# Altium project PCB_Project.PrjPcb
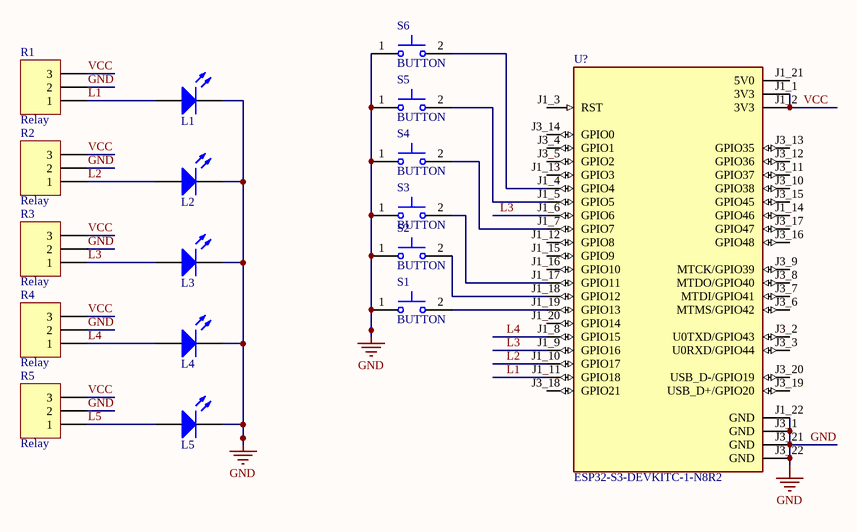
[diagram p0: Sheet1.SchDoc]
3 sheets, 39 parts. Net scope: global (net labels, ports and power ports of the same name join across sheets).
Sheets:
  Sheet1.SchDoc
  Sheet2.SchDoc
  Sheet3.SchDoc

## Sheet Sheet1.SchDoc
size A; SheetNumber: 1; SheetTotal: 1

### Parts
(Parts that share a designator on the sheet are numbered #1, #2 ... from top to bottom, then left to right.)
L1  LED 0805 SMD  [LED 0805 SMD]  (value not drawn)
L2  LED 0805 SMD  [LED 0805 SMD]  (value not drawn)
L3  LED 0805 SMD  [LED 0805 SMD]  (value not drawn)
L4  LED 0805 SMD  [LED 0805 SMD]  (value not drawn)
L5  LED 0805 SMD  [LED 0805 SMD]  (value not drawn)
R1  Relay  [HDR1X3]
R2  Relay  [HDR1X3]
R3  Relay  [HDR1X3]
R4  Relay  [HDR1X3]
R5  Relay  [HDR1X3]
S1  BUTTON  [SW_BUTT-2 pin]
S2  BUTTON  [SW_BUTT-2 pin]
S3  BUTTON  [SW_BUTT-2 pin]
S4  BUTTON  [SW_BUTT-2 pin]
S5  BUTTON  [SW_BUTT-2 pin]
S6  BUTTON  [SW_BUTT-2 pin]
U?#1  ESP32-S3-DEVKITC-1-N8R2  [XCVR_ESP32-S3-DEVKITC-1-N8R2]

### Nets
GND: L1.2(K) L2.2(K) L3.2(K) L4.2(K) L5.2(K) R1.2 R2.2 R3.2 R4.2 R5.2 S1.1 S2.1 S3.1 S4.1 S5.1 S6.1 U?#1.J1_22(GND) U?#1.J3_1(GND) U?#1.J3_21(GND) U?#1.J3_22(GND)
L1: L1.1(A) R1.1 U?#1.J1_11(GPIO18)
L2: L2.1(A) R2.1 U?#1.J1_10(GPIO17)
L3: L3.1(A) R3.1 U?#1.J1_6(GPIO6) U?#1.J1_9(GPIO16)
L4: L4.1(A) R4.1 U?#1.J1_8(GPIO15)
L5: L5.1(A) R5.1
VCC: R1.3 R2.3 R3.3 R4.3 R5.3 U?#1.J1_1(3V3) U?#1.J1_2(3V3)
NetS1_2: S1.2 U?#1.J1_19(GPIO13)
NetS2_2: S2.2 U?#1.J1_18(GPIO12)
NetS3_2: S3.2 U?#1.J1_17(GPIO11)
NetS4_2: S4.2 U?#1.J1_7(GPIO7)
NetS5_2: S5.2 U?#1.J1_5(GPIO5)
NetS6_2: S6.2 U?#1.J1_4(GPIO4)

Not connected (* = marked no-connect by the designer): U?#1 J1_3(RST) J1_12(GPIO8) J1_13(GPIO3) J1_14(GPIO46) J1_15(GPIO9) J1_16(GPIO10) J1_20(GPIO14) J1_21(5V0) J3_2(U0TXD/GPIO43) J3_3(U0RXD/GPIO44) J3_4(GPIO1) J3_5(GPIO2) J3_6(MTMS/GPIO42) J3_7(MTDI/GPIO41) J3_8(MTDO/GPIO40) J3_9(MTCK/GPIO39) J3_10(GPIO38) J3_11(GPIO37) J3_12(GPIO36) J3_13(GPIO35) J3_14(GPIO0) J3_15(GPIO45) J3_16(GPIO48) J3_17(GPIO47) J3_18(GPIO21) J3_19(USB_D+/GPIO20) J3_20(USB_D-/GPIO19)

### Library data of the parts
L1-L5 = LED 0805 SMD: Green 571nm LED Indication - Discrete 2V 0805 (2012 Metric); Supplier 1: Digi-Key; Supplier Part Number 1: 160-1426-1-ND; Value: LED 0805 SMD
R1-R5 = Header 3X1: CONN HEADER 3POS .100" SINGL TIN; LatestRevisionDate: 17-Jul-2002; LatestRevisionNote: Re-released for DXP Platform.; Publisher: Altium Limited; Supplier 1: Digi-Key; Supplier Part Number 1: SAM1035-03-ND; Value: Relay
S1-S6 = BUTT-2: Tactile Switches MINI PUSH BUTTON SWITCH 2-PIN QTY. 4; MF: Gravitech; Mouser-Purchase-URL: https://snapeda.com/shop?store=Mouser&id=885822; Price: None; Package: None; Value: *; MP: BUTT-2; SnapEDA_Link: https://www.snapeda.com/parts/BUTT-2/Gravitech/view-part/885822/?ref=snap; Availability: Warning
U?#1 = ESP32-S3-DEVKITC-1-N8R2: WiFi Development Tools - 802.11 (Engineering Samples Only) ESP32-S3 General-Purpose Development Board, ESP32-S3-WROOM-1-N8R2, with Pin Header; MF: Espressif Systems; SnapEDA_Link: https://www.snapeda.com/parts/ESP32-S3-DEVKITC-1-N8R2/Espressif+Systems/view-part/?ref=snap; Package: None; Value: *; MP: ESP32-S3-DEVKITC-1-N8R2; Check_prices: https://www.snapeda.com/parts/ESP32-S3-DEVKITC-1-N8R2/Espressif+Systems/view-part/?ref=eda

## Sheet Sheet2.SchDoc
size A; SheetNumber: 2; SheetTotal: 2
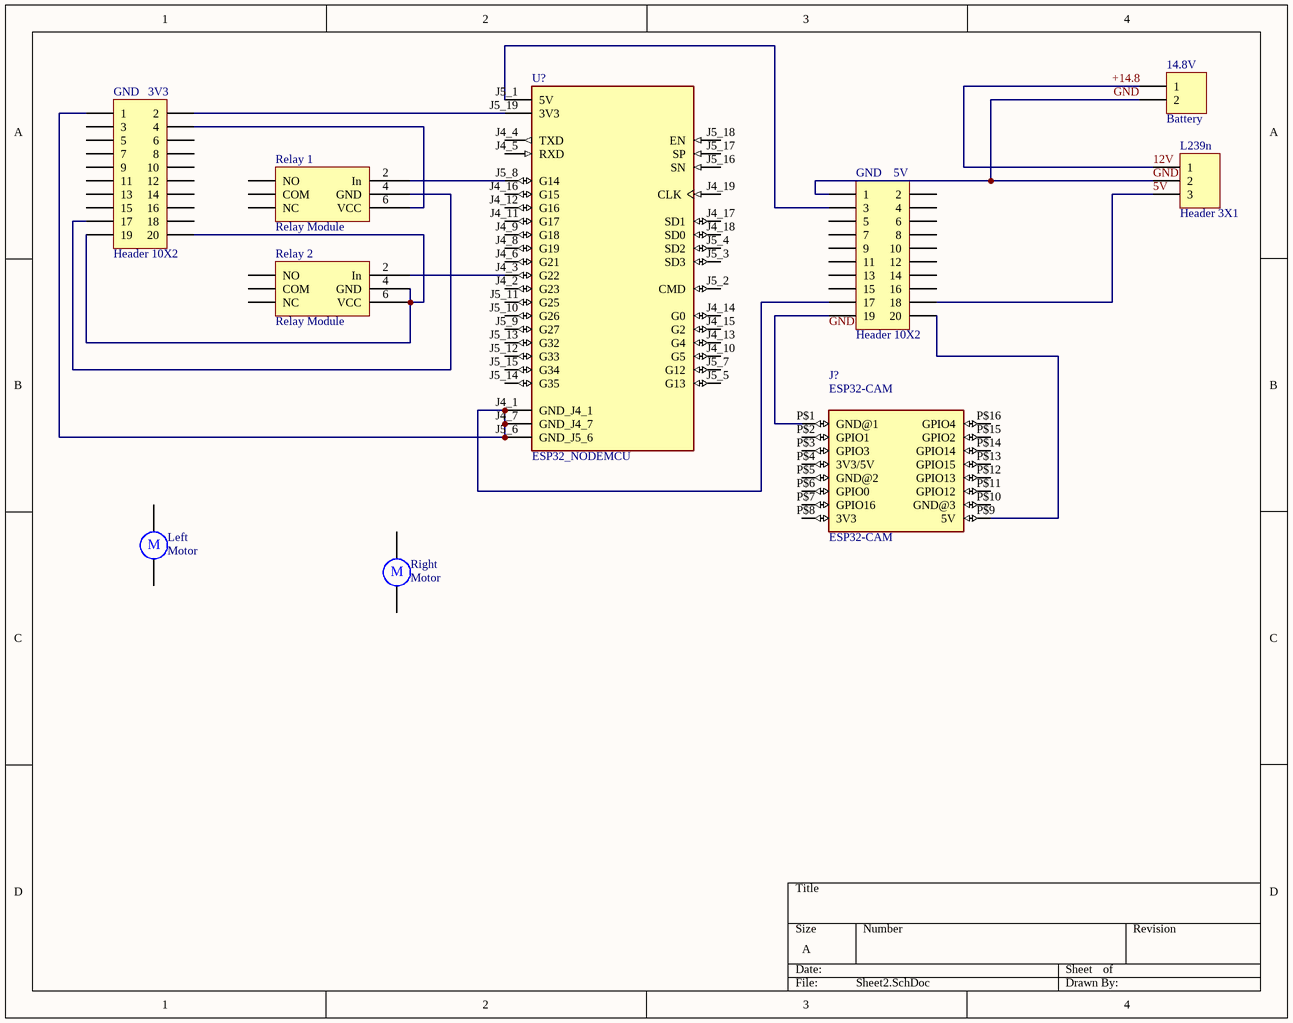
[diagram p1: Sheet2.SchDoc]

### Parts
(Parts that share a designator on the sheet are numbered #1, #2 ... from top to bottom, then left to right.)
14.8V  Battery  [HDR1X2_R]
GND_3V3  Header 10X2  [HDR2X10]
GND_5V  Header 10X2  [HDR2X10]
J?#1  ESP32-CAM  [ESP32-CAM]
L239n  Header 3X1  [HDR1X3]
Left  Motor  [RB5-10.5]
Relay_1  Relay Module  [HDR3X2]
Relay_2  Relay Module  [HDR3X2]
Right  Motor  [RB5-10.5]
U?#2  ESP32_NODEMCU  [MODULE_ESP32_NODEMCU]

### Nets
GND: 14.8V.2 GND_5V.1 L239n.2
5V: GND_5V.18 L239n.3
+14.8: 14.8V.1 L239n.1  [also labelled 12V]
NetGND_3V3_1: GND_3V3.1 GND_5V.17 U?#2.J4_1(GND_J4_1) U?#2.J4_7(GND_J4_7) U?#2.J5_6(GND_J5_6)
NetGND_3V3_2: GND_3V3.2 U?#2.J5_19(3V3)
NetGND_3V3_4: GND_3V3.4 Relay_1.6(VCC)
NetGND_3V3_17: GND_3V3.17 Relay_1.4(GND)
NetGND_3V3_19: GND_3V3.19 GND_3V3.20 Relay_2.4(GND) Relay_2.6(VCC)
NetGND_5V_3: GND_5V.3 U?#2.J5_1(5V)
NetGND_5V_19: GND_5V.19 J?#1.P$1(GND@1)
NetGND_5V_20: GND_5V.20 J?#1.P$9(5V)
NetRelay_1_2: Relay_1.2(In) U?#2.J5_8(G14)
NetRelay_2_2: Relay_2.2(In) U?#2.J4_3(G22)

Not connected (* = marked no-connect by the designer): GND_3V3 3 5 6 7 8 9 10 11 12 13 14 15 16 18; GND_5V 2 4 5 6 7 8 9 10 11 12 13 14 15 16; J?#1 P$2(GPIO1) P$3(GPIO3) P$4(3V3/5V) P$5(GND@2) P$6(GPIO0) P$7(GPIO16) P$8(3V3) P$10(GND@3) P$11(GPIO12) P$12(GPIO13) P$13(GPIO15) P$14(GPIO14) P$15(GPIO2) P$16(GPIO4); Left 1 2; Relay_1 1(NO) 3(COM) 5(NC); Relay_2 1(NO) 3(COM) 5(NC); Right 1 2; U?#2 J4_2(G23) J4_4(TXD) J4_5(RXD) J4_6(G21) J4_8(G19) J4_9(G18) J4_10(G5) J4_11(G17) J4_12(G16) J4_13(G4) J4_14(G0) J4_15(G2) J4_16(G15) J4_17(SD1) J4_18(SD0) J4_19(CLK) J5_2(CMD) J5_3(SD3) J5_4(SD2) J5_5(G13) J5_7(G12) J5_9(G27) J5_10(G26) J5_11(G25) J5_12(G33) J5_13(G32) J5_14(G35) J5_15(G34) J5_16(SN) J5_17(SP) J5_18(EN)

### Notes on the sheet
- Labels drawn without touching a wire or pin: GND
- (in symbol Motor) M

### Library data of the parts
14.8V = Socket_2X1: SOCKET 2POS .100" SINGL TIN; LatestRevisionDate: 17-Jul-2002; LatestRevisionNote: Re-released for DXP Platform.; Publisher: Altium Limited; Supplier 1: Digi-Key; Supplier Part Number 1: ED11155-ND; Value: Battery
GND_3V3 GND_5V = Header 10X2: Header, 10-Pin, Dual row; LatestRevisionDate: 17-Jul-2002; LatestRevisionNote: Re-released for DXP Platform.; Publisher: Altium Limited
J?#1 = ESP32-CAM: ESP32 ESP32 Transceiver; 802.11 a/b/g/n (Wi-Fi, WiFi, WLAN), BluetoothÂ® Smart 4.x Low Energy (BLE) Evaluation Board; MF: AI-Thinker; SnapEDA_Link: https://www.snapeda.com/parts/ESP32-CAM/AI-Thinker/view-part/?ref=snap; Package: None; Value: *; MP: ESP32-CAM; Check_prices: https://www.snapeda.com/parts/ESP32-CAM/AI-Thinker/view-part/?ref=eda
L239n = Header 3X1: CONN HEADER 3POS .100" SINGL TIN; LatestRevisionDate: 17-Jul-2002; LatestRevisionNote: Re-released for DXP Platform.; Publisher: Altium Limited; Supplier 1: Digi-Key; Supplier Part Number 1: SAM1035-03-ND; Value: Header 3X1
Left Right = Motor: Motor, General Kind; Published: 24-Mar-1999; LatestRevisionDate: 17-Jul-2002; LatestRevisionNote: Re-released for DXP Platform.; PackageReference: RB5-10.5; Publisher: Altium Limited; PackageDescription: Capacitor (Radial); 2 Leads
Relay_1 Relay_2 = Relay: CONN HEADER 3POS .100" SINGL TIN; LatestRevisionDate: 17-Jul-2002; LatestRevisionNote: Re-released for DXP Platform.; Publisher: Altium Limited; Supplier 1: Digi-Key; Supplier Part Number 1: SAM1035-03-ND; Value: Relay Module
U?#2 = ESP32_NODEMCU: NodeMCU is an open source loT platform. ESP32 is a series of low cost, low powersystem-on-chip (SoC) microcontrollers with integrated Wi-Fi & dual-mode Bluetooth.; MP: ESP32 NodeMCU; MF: Espressif Systems; Package: Package; SnapEDA_Link: https://www.snapeda.com/parts/ESP32%20NodeMCU/Espressif+Systems/view-part/?ref=snap; Availability: Not in stock; Value: *; Check_prices: https://www.snapeda.com/parts/ESP32%20NodeMCU/Espressif+Systems/view-part/?ref=eda; Price: None

## Sheet Sheet3.SchDoc
size A; SheetNumber: 3; SheetTotal: 3
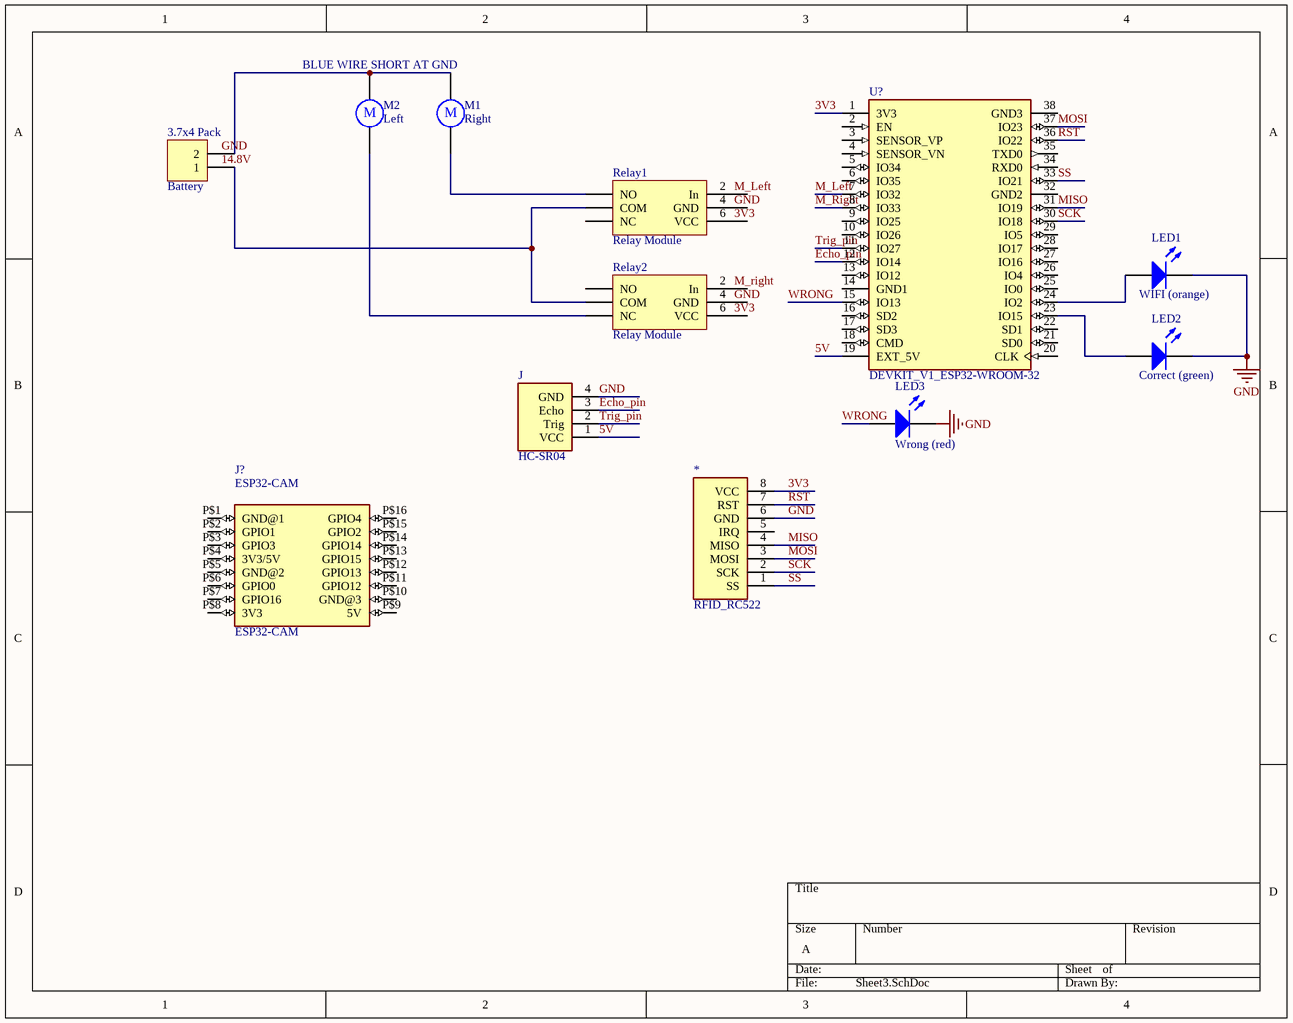
[diagram p2: Sheet3.SchDoc]

### Parts
(Parts that share a designator on the sheet are numbered #1, #2 ... from top to bottom, then left to right.)
3.7x4_Pack  Battery  [HDR1X2_R]
*  RFID_RC522
J  HC-SR04  [TE_282822-4]
J?#2  ESP32-CAM  [ESP32-CAM]
LED1  WIFI (orange)  [LED 0805 SMD]
LED2  Correct (green)  [LED 0805 SMD]
LED3  Wrong (red)  [LED 0805 SMD]
M1  Right  [RB5-10.5]
M2  Left  [RB5-10.5]
Relay1  Relay Module  [HDR3X2]
Relay2  Relay Module  [HDR3X2]
U?#3  DEVKIT_V1_ESP32-WROOM-32  [MODULE_DEVKIT_V1_ESP32-WROOM-32]

### Nets
GND: *.6(GND) J.4(GND) LED1.2(K) LED2.2(K) LED3.2(K)
3V3: *.8(VCC) U?#3.1(3V3)
5V: J.1(VCC) U?#3.19(EXT_5V)
Echo_pin: J.3(Echo) U?#3.12(IO14)
M_Left: U?#3.7(IO32)
M_Right: U?#3.8(IO33)
MISO: *.4(MISO) U?#3.31(IO19)
MOSI: *.3(MOSI) U?#3.37(IO23)
RST: *.7(RST) U?#3.36(IO22)
SCK: *.2(SCK) U?#3.30(IO18)
SS: *.1(SS) U?#3.33(IO21)
Trig_pin: J.2(Trig) U?#3.11(IO27)
WRONG: LED3.1(A) U?#3.15(IO13)
Net3.7x4_Pack_1: 3.7x4_Pack.1 Relay1.3(COM) Relay2.3(COM)
Net3.7x4_Pack_2: 3.7x4_Pack.2 M1.1 M2.1
NetLED1_1: LED1.1(A) U?#3.24(IO2)
NetLED2_1: LED2.1(A) U?#3.23(IO15)
NetM1_2: M1.2 Relay1.1(NO)
NetM2_2: M2.2 Relay2.5(NC)

Not connected (* = marked no-connect by the designer): * 5(IRQ); J?#2 P$1(GND@1) P$2(GPIO1) P$3(GPIO3) P$4(3V3/5V) P$5(GND@2) P$6(GPIO0) P$7(GPIO16) P$8(3V3) P$9(5V) P$10(GND@3) P$11(GPIO12) P$12(GPIO13) P$13(GPIO15) P$14(GPIO14) P$15(GPIO2) P$16(GPIO4); Relay1 2(In) 4(GND) 5(NC) 6(VCC); Relay2 1(NO) 2(In) 4(GND) 6(VCC); U?#3 2(EN) 3(SENSOR_VP) 4(SENSOR_VN) 5(IO34) 6(IO35) 9(IO25) 10(IO26) 13(IO12) 14(GND1) 16(SD2) 17(SD3) 18(CMD) 20(CLK) 21(SD0) 22(SD1) 25(IO0) 26(IO4) 27(IO16) 28(IO17) 29(IO5) 32(GND2) 34(RXD0) 35(TXD0) 38(GND3)

### Notes on the sheet
- BLUE WIRE SHORT AT GND
- Labels drawn without touching a wire or pin: 3V3, 14.8V, GND, M_Left, M_right
- (in symbol Motor) M

### Library data of the parts
3.7x4_Pack = Socket_2X1: SOCKET 2POS .100" SINGL TIN; LatestRevisionDate: 17-Jul-2002; LatestRevisionNote: Re-released for DXP Platform.; Publisher: Altium Limited; Supplier 1: Digi-Key; Supplier Part Number 1: ED11155-ND; Value: Battery
J = HC-SR04: TERMI-BLOK HEADER,ASSY90 4P.; MF: TE Connectivity; MP: 282822-4; SnapEDA_Link: https://www.snapeda.com/parts/282822-4/TE%20Connectivity%20AMP%20Connectors/view-part/2404770/?ref=snap; EU_RoHS_Compliance: Compliant; Value: *; DigiKey-Purchase-URL: https://snapeda.com/shop?store=DigiKey&id=2404770; Package: None; Price: None; Availability: Good; Mouser-Purchase-URL: https://snapeda.com/shop?store=Mouser&id=2404770
J?#2 = ESP32-CAM: as J?#1 on sheet Sheet2; SnapEDA_Link: https://www.snapeda.com/parts/ESP32-CAM/AI-Thinker/view-part/?ref=snap; Package: None; Value: *; MP: ESP32-CAM; Check_prices: https://www.snapeda.com/parts/ESP32-CAM/AI-Thinker/view-part/?ref=eda
LED1-LED3 = LED 0805 SMD: as L1 on sheet Sheet1; Supplier 1: Digi-Key; Supplier Part Number 1: 160-1426-1-ND
  LED1: Value: WIFI (orange)
  LED2: Value: Correct (green)
  LED3: Value: Wrong (red)
M1 M2 = Motor: Motor, General Kind; Published: 24-Mar-1999; LatestRevisionDate: 17-Jul-2002; LatestRevisionNote: Re-released for DXP Platform.; PackageReference: RB5-10.5; Publisher: Altium Limited; PackageDescription: Capacitor (Radial); 2 Leads
Relay1 Relay2 = Relay: CONN HEADER 3POS .100" SINGL TIN; LatestRevisionDate: 17-Jul-2002; LatestRevisionNote: Re-released for DXP Platform.; Publisher: Altium Limited; Supplier 1: Digi-Key; Supplier Part Number 1: SAM1035-03-ND; Value: Relay Module
U?#3 = DEVKIT_V1_ESP32-WROOM-32: WROOM-32 Development Board ESP32 ESP-32S WiFi Bluetooth Dev Module; MF: Espressif Systems; MP: DEVKIT V1 ESP32-WROOM-32; SnapEDA_Link: https://www.snapeda.com/parts/DEVKIT%20V1%20ESP32-WROOM-32/Espressif+Systems/view-part/?ref=snap; Package: Package; Value: *; Check_prices: https://www.snapeda.com/parts/DEVKIT%20V1%20ESP32-WROOM-32/Espressif+Systems/view-part/?ref=eda

## Nets that join several sheets
GND: Sheet1 (20 pins), Sheet2 (14.8V.2 GND_5V.1 L239n.2), Sheet3 (5 pins)
5V: Sheet2 (GND_5V.18 L239n.3), Sheet3 (J.1 U?#3.19)